# EAGLE design powermeter (EAGLE 5.11)
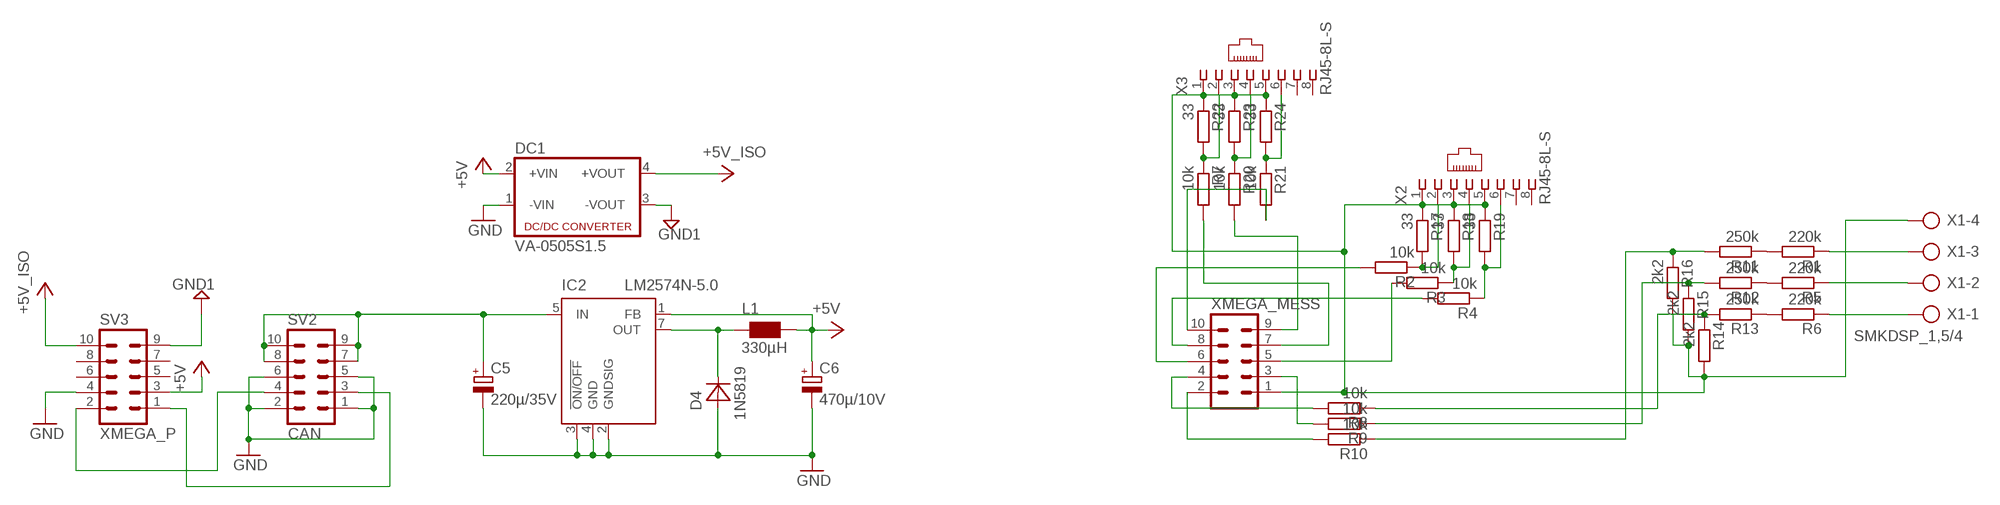
[diagram p0: schematic, sheet 1]

## Parts
C5  220µ/35V  CPOL-EUE3.5-8  [E3,5-8]
C6  470µ/10V  CPOL-EUE3.5-8  [E3,5-8]
D4  1N5819  DIODE  [DO41-7]
DC1  VA-0505S1.5  [4SIL]
IC2  LM2574N-5.0  LM2574N-3.3  [DIL08]
L1  330µH  L  [FASTRON-09P]
R1  220k  R-EU_0207/10  [0207/10]
R2  10k  R-EU_M0805  [M0805]
R3  10k  R-EU_M0805  [M0805]
R4  10k  R-EU_M0805  [M0805]
R5  220k  R-EU_0207/10  [0207/10]
R6  220k  R-EU_0207/10  [0207/10]
R7  10k  R-EU_M0805  [M0805]
R8  10k  R-EU_M0805  [M0805]
R9  10k  R-EU_M0805  [M0805]
R10  10k  R-EU_M0805  [M0805]
R11  250k  R-EU_0207/10  [0207/10]
R12  250k  R-EU_0207/10  [0207/10]
R13  250k  R-EU_0207/10  [0207/10]
R14  2k2  R-EU_0207/10  [0207/10]
R15  2k2  R-EU_0207/10  [0207/10]
R16  2k2  R-EU_0207/10  [0207/10]
R17  33  R-EU_M0805  [M0805]
R18  33  R-EU_M0805  [M0805]
R19  33  R-EU_M0805  [M0805]
R20  10k  R-EU_M0805  [M0805]
R21  10k  R-EU_M0805  [M0805]
R22  33  R-EU_M0805  [M0805]
R23  33  R-EU_M0805  [M0805]
R24  33  R-EU_M0805  [M0805]
SV2  CAN  ML10L  [ML10L]
SV3  XMEGA_P  ML10  [ML10]
X1  SMKDSP_1,5/4  [SMKDSP_1,5/4]
X2  RJ45-8L-S  [RJ45-NO-SHIELD]
X3  RJ45-8L-S  [RJ45-NO-SHIELD]
XMEGA_MESS  ML10  [ML10]

## Nets
+5V: C6.+ IC2.1(FB) L1.2 SV3.3
+5V_ISO: DC1.4(+VOUT) SV3.10
+5VISO: DC1.2(+VIN) ; supply symbol labelled +5V
+V: C5.+ IC2.5(IN) SV2.7 SV2.8 SV2.9 SV2.10
GND: C5.- C6.- D4.A DC1.1(-VIN) IC2.2(GNDSIG) IC2.3(!ON/OFF) IC2.4(GND) SV2.1 SV2.2 SV2.5 SV2.6 SV3.4
GND1: DC1.3(-VOUT) SV3.9
N$1: R10.2 XMEGA_MESS.2
N$2: R1.2 R11.1
N$3: R5.2 R12.1
N$4: R6.2 R13.1
N$5: R6.1 X1.1
N$6: R5.1 X1.2
N$7: R1.1 X1.3
N$8: R9.2 XMEGA_MESS.3
N$9: R8.2 XMEGA_MESS.4
N$10: R7.1 R22.2 X3.2
N$11: R3.2 XMEGA_MESS.5
N$12: R8.1 R13.2 R14.1
N$13: R9.1 R12.2 R15.1
N$14: R10.1 R11.2 R16.1
N$15: D4.C IC2.7(OUT) L1.1
N$16: R4.2 XMEGA_MESS.8
N$17: SV2.4 SV3.2
N$18: SV2.3 SV3.1
N$19: R20.1 R23.2 X3.4
N$20: R2.2 XMEGA_MESS.6
N$21: R21.1 R24.2 X3.6
N$22: R7.2 XMEGA_MESS.7
N$23: R20.2 XMEGA_MESS.9
N$24: R21.2 XMEGA_MESS.10
N$28: R2.1 R17.2 X2.2
N$29: R3.1 R18.2 X2.4
N$30: R4.1 R19.2 X2.6
VGND: R14.2 R15.2 R16.2 R17.1 R18.1 R19.1 R22.1 R23.1 R24.1 X1.4 X2.1 X2.3 X2.5 X3.1 X3.3 X3.5 XMEGA_MESS.1
Unconnected: SV3.5 SV3.6 SV3.7 SV3.8 X2.7 X2.8 X3.7 X3.8

## Library data of the parts
C5 C6 = rcl:CPOL-EU: POLARIZED CAPACITOR, European symbol
D4 = lab_node:DIODE
DC1 = dc-dc-converter:VA-*?: DC DC Converter Single Output, 1 Watt Motien Technology Co.,Ltd. Source: va-serie.pdf
IC2 = linear:LM2574?-*: SIMPLE SWITCHER 0.5A Step-Down Voltage Regulator Source: http://cache.national.com/ds/LM/LM2574.pdf
L1 = lab_node:L
R1-R24 = rcl:R-EU_: RESISTOR, European symbol
SV2 = con-ml:ML10L: HARTING
SV3 XMEGA_MESS = con-ml:ML10: HARTING
X1 = con-phoenix-smkdsp:SMKDSP_1,5/4: Printklemme, Nennstrom: 17,5 A, Bemessungsspannung: 250 V, Raster: 5,0 mm Source: http://eshop.phoenixcontact.de .. 1733415.pdf
X2 X3 = con-tycoelectronics:RJ45: CORCOM Modular RJ Jacks No Shield Source: www.tycoelectronics.com .. ENG_DS_1654001_1099_RJ_L_0507.pdf

## Board
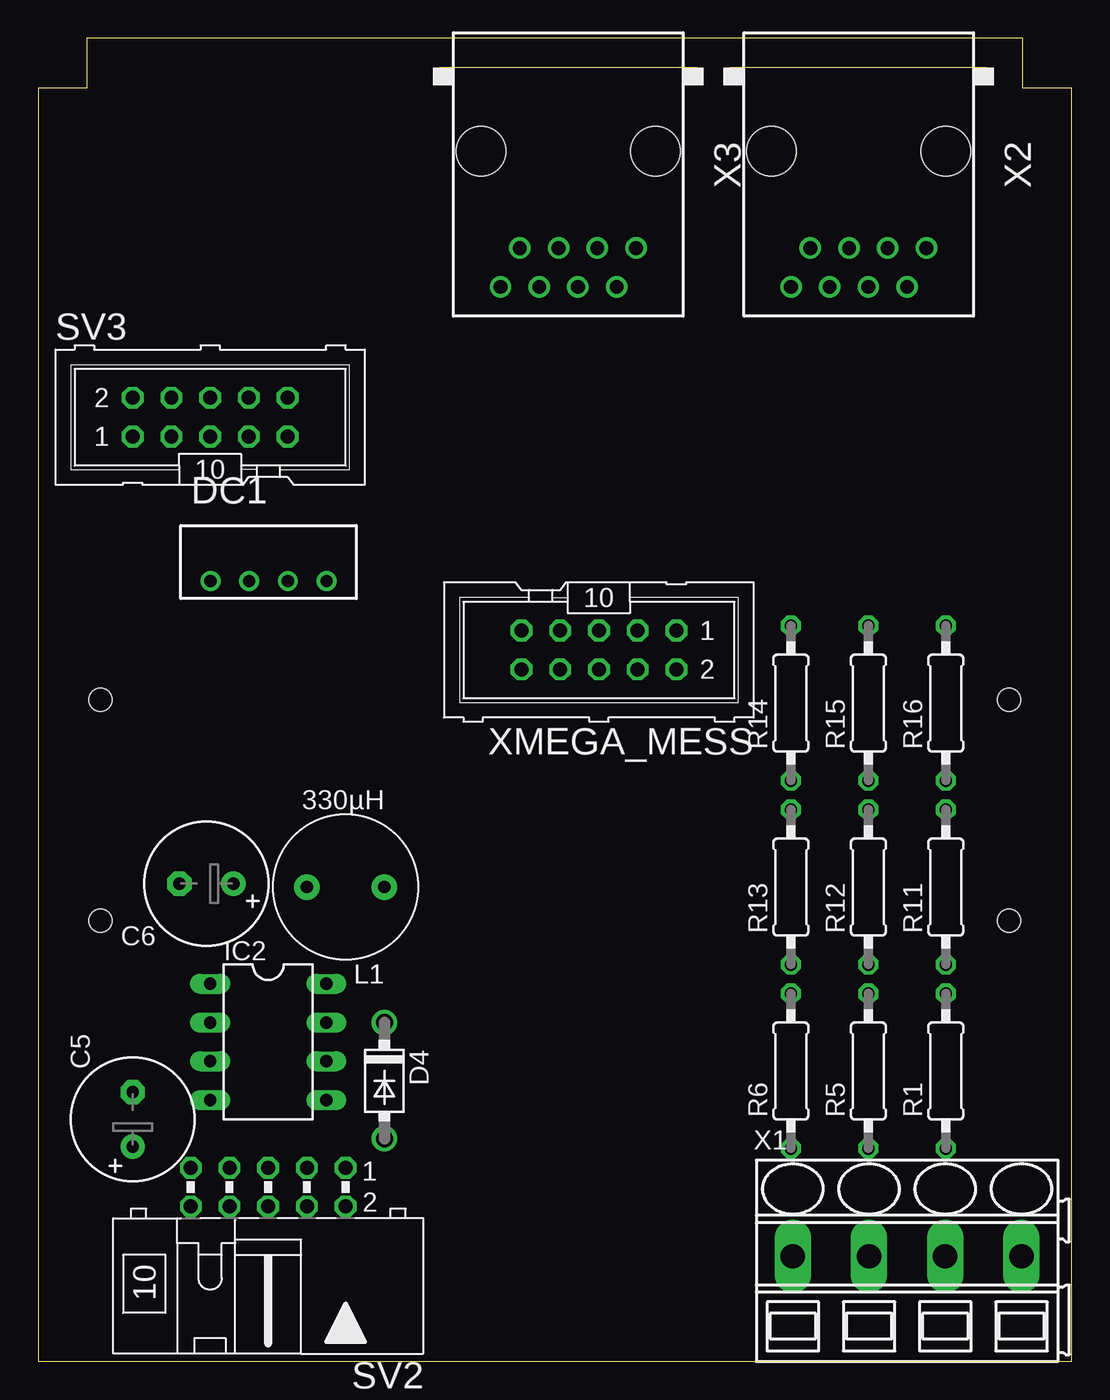
[diagram p1: board, top side]
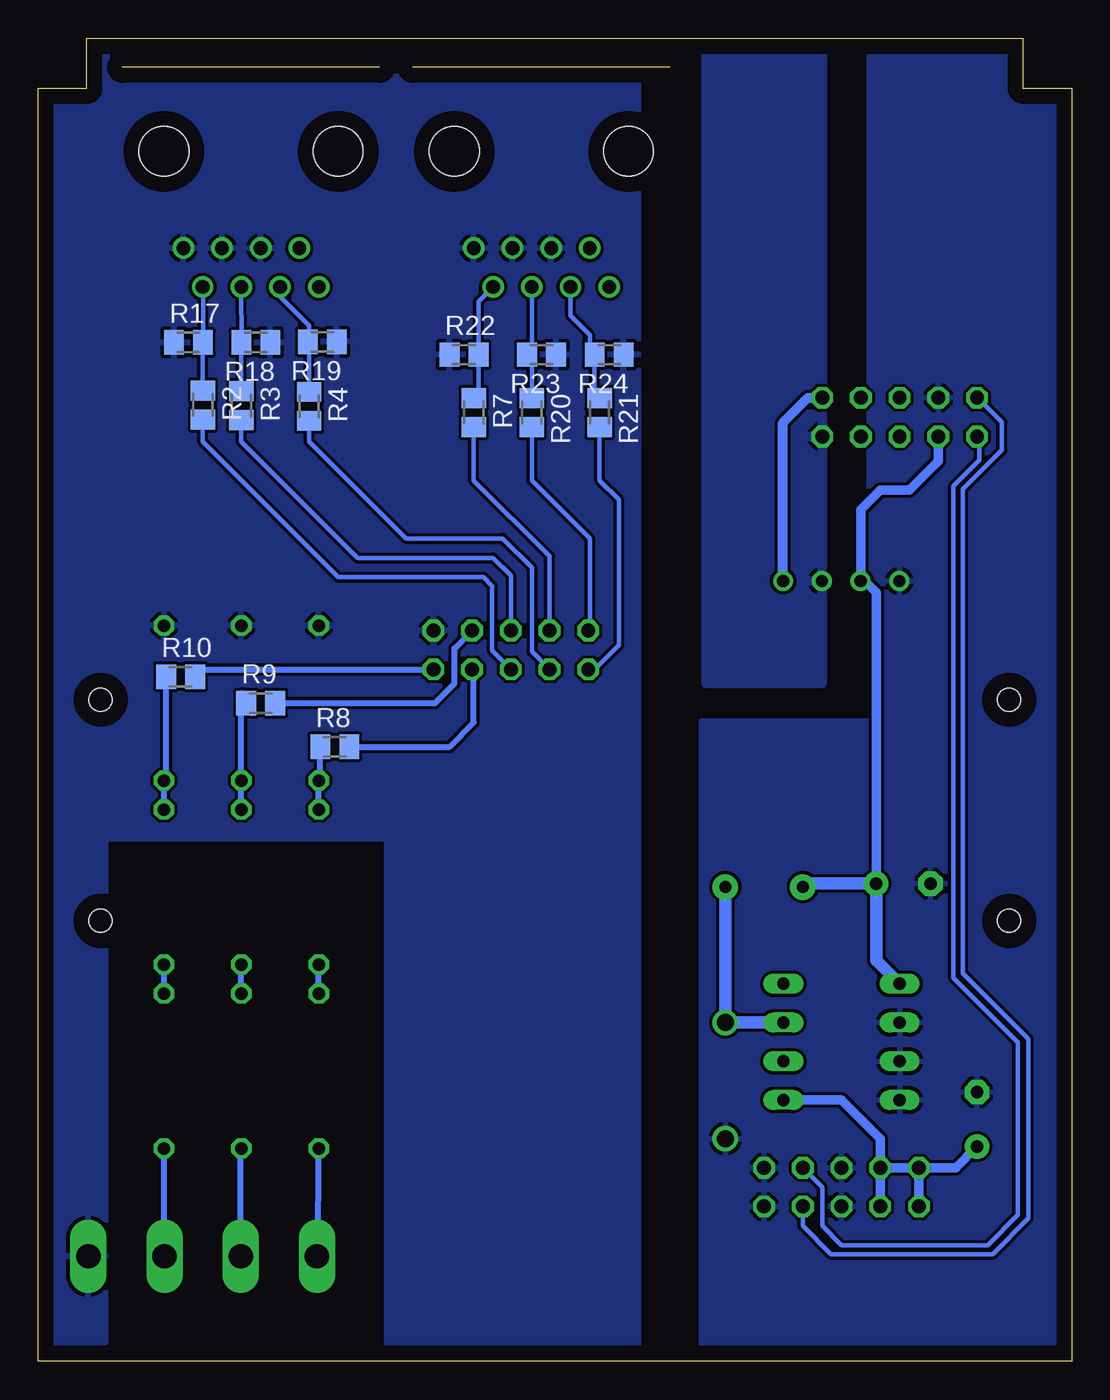
[diagram p2: board, bottom side, seen from below]

Size 67.8 x 86.8 mm. Coordinates in mm from the lower left corner, seen from the top.
Outline: 67.8,0 67.8,83.5 64.6,83.5 64.6,86.8 3.2,86.8 3.2,83.5 0,83.5 0,0 67.8,0
Copper layers (1*16): Top 0.035mm / dielectric 1.5mm / Bottom 0.035mm
Design rules: minimum track width 10mil, minimum drill 24mil, track to track 8mil, track to pad 8mil, pad to pad 8mil, via to via 8mil, smd to smd 8mil, copper to edge 40mil, drill to drill 8mil, minimum pad ring 10mil, minimum via ring 8mil, stop-mask expansion 4mil, vias tented up to drill 0mil, thermal gap 10mil
Holes 1.5 mm at 4.1,43.4 4.1,28.9 63.7,43.4 63.7,28.9

### Footprints (pad centres in the part's own frame; a part is rotated, then mirrored left to right if it is on the bottom)
E3,5-8 = drill 0.813 pad 1.6: + -1.778,0 | drill 0.813 pad 1.6 octagon: - 1.778,0
DO41-7 = drill 1.118: A 3.81,0; C -3.81,0
4SIL = drill 0.8: 1 -3.81,0; 2 -1.27,0; 3 1.27,0; 4 3.81,0
DIL08 = drill 0.813 long: 1 -3.81,-3.81; 2 -1.27,-3.81; 3 1.27,-3.81; 4 3.81,-3.81; 5 3.81,3.81; 6 1.27,3.81; 7 -1.27,3.81; 8 -3.81,3.81
FASTRON-09P = drill 0.8 pad 1.676: 1 -2.54,0; 2 2.54,0
0207/10 = drill 0.813 octagon: 1 -5.08,0; 2 5.08,0
M0805 = smd 1.3 x 1.6: 1 -0.95,0; 2 0.95,0
ML10L = drill 0.914 octagon: 1 -5.08,-1.27; 2 -5.08,1.27; 3 -2.54,-1.27; 4 -2.54,1.27; 5 0,-1.27; 6 0,1.27; 7 2.54,-1.27; 8 2.54,1.27; 9 5.08,-1.27; 10 5.08,1.27
ML10 = drill 0.914 octagon: 1 -5.08,-1.27; 2 -5.08,1.27; 3 -2.54,-1.27; 4 -2.54,1.27; 5 0,-1.27; 6 0,1.27; 7 2.54,-1.27; 8 2.54,1.27; 9 5.08,-1.27; 10 5.08,1.27
SMKDSP_1,5/4 = drill 1.6 pad 1.8 long: 1 -2.5,0; 2 2.5,0; 3 7.5,0; 4 12.5,0
RJ45-NO-SHIELD = drill 0.9 pad 1.4: 1 -4.445,6.35; 2 -3.175,8.89; 3 -1.905,6.35; 4 -0.635,8.89; 5 0.635,6.35; 6 1.905,8.89; 7 3.175,6.35; 8 4.445,8.89 | hole 3.251: -5.715,0; 5.715,0

### Placement (x,y rotation side)
C5  6.21,15.88 90 top
C6  11.04,31.34 180 top
D4  22.71,18.41 270 top
DC1  15.12,51.19 0 top
IC2  15.1,20.95 270 top
L1  20.18,31.11 180 top
R1  59.54,19.05 90 top
R2  56.99,62.73 270 bottom
R3  54.47,62.7 270 bottom
R4  50.02,62.65 270 bottom
R5  54.46,19.05 90 top
R6  49.38,19.05 90 top
R7  39.22,62.23 270 bottom
R8  48.33,40.31 0 bottom
R9  53.2,43.18 0 bottom
R10  58.45,44.91 0 bottom
R11  59.54,31.11 90 top
R12  54.46,31.11 90 top
R13  49.38,31.11 90 top
R14  49.38,43.18 90 top
R15  54.46,43.18 90 top
R16  59.54,43.18 90 top
R17  57.93,66.83 0 bottom
R18  53.51,66.84 180 bottom
R19  49.15,66.88 180 bottom
R20  35.41,62.23 270 bottom
R21  30.97,62.23 270 bottom
R22  39.86,66.04 0 bottom
R23  34.78,66.04 180 bottom
R24  30.34,66.04 180 bottom
SV2  15.1,11.43 180 top
SV3  11.29,61.94 0 top
X1  52.01,6.89 0 top
X2  53.83,79.38 180 top
X3  34.78,79.38 180 top
XMEGA_MESS  36.79,46.66 180 top

### Tracks (layer width: path | path; a pad name or v marks a point on that pad's centre or on a via)
+5V
  Bottom 0.61: SV3.3 8.75,59.05 10.65,57.15 12.55,57.15 13.83,55.88 13.83,51.44 12.82,50.43 C6.+
  Bottom 0.813: IC2.1 12.82,26.3 C6.+ 17.41,31.34 L1.2
+5V_ISO
  Bottom 0.65: DC1.4 18.93,61.58 17.3,63.2 SV3.10
+V
  Bottom 0.61: SV2.9 SV2.10 | SV2.8 SV2.7 | SV2.7 SV2.9 | IC2.5 15.1,17.14 12.55,14.61 SV2.7 | SV2.9 7.6,12.7 C5.+
GND
  pour Bottom: -0.7,-1 -0.7,86.67 13.3,86.67 13.3,42 24.3,42 24.3,-1
GND1
  pour Bottom: 16.37,44.45 16.37,87.63 23.98,87.63 23.98,44.45
N$1
  Bottom 0.406: XMEGA_MESS.2 57.02,45.4 R10.2
N$2
  Bottom 0.406: R1.2 R11.1
N$3
  Bottom 0.406: R5.2 R12.1
N$4
  Bottom 0.406: R6.2 R13.1
N$5
  Bottom 0.406: X1.1 49.42,6.99 R6.1
N$6
  Bottom 0.406: R5.1 54.51,13.93 X1.2
N$7
  Bottom 0.406: X1.3 59.54,6.93 R1.1
N$8
  Bottom 0.406: R9.2 41.76,43.18 40.49,44.45 40.49,46.77 XMEGA_MESS.3
N$9
  Bottom 0.406: R8.2 40.82,40.31 39.22,41.91 39.22,45.29 XMEGA_MESS.4
N$10
  Bottom 0.305: X3.2 38.91,69.53 R22.2 38.91,63.49 R7.1
N$11
  Bottom 0.305: 36.77,47.95 XMEGA_MESS.5 36.79,51.54 37.95,52.7 46.84,52.7 54.46,60.33 R3.2
N$12
  Bottom 0.406: R13.2 R14.1 49.28,38.2 R8.1
N$13
  Bottom 0.406: R12.2 R15.1 54.46,43.81 arc90 54.14,43.49 R9.1
N$14
  Bottom 0.406: R11.2 R16.1 arc-90 59.4,38.24 R10.1
N$15
  Bottom 0.813: IC2.7 D4.C L1.1
N$16
  Bottom 0.305: R4.2 50.02,60.33 43.67,53.98 37.32,53.98 35.41,52.07 35.41,46.56 XMEGA_MESS.8
N$17
  Bottom 0.305: SV2.4 17.64,8.89 15.79,7.04 5.18,7.04 2.85,9.37 2.85,21.17 7.13,25.45 7.13,57.21 4.57,59.77 4.57,61.6 6.18,63.2 SV3.2
N$18
  Bottom 0.305: SV2.3 16.37,11.43 16.37,8.89 15.1,7.62 5.5,7.62 3.52,9.6 3.52,20.93 7.76,25.17 7.76,57.41 6.04,59.13 6.04,60.5 SV3.1
N$19
  Bottom 0.305: R20.1 35.41,65.72 R23.2 35.41,66.36 X3.4
N$20
  Bottom 0.305: XMEGA_MESS.6 38.02,46.62 38.02,50.87 38.59,51.44 48.11,51.44 57,60.33 57,61.77 R2.2
N$21
  Bottom 0.305: X3.6 32.88,68.58 31.61,67.31 31.61,66.36 R24.2 31.29,63.49 R21.1
N$22
  Bottom 0.305: XMEGA_MESS.7 34.25,52.81 39.22,57.78 R7.2
N$23
  Bottom 0.305: XMEGA_MESS.9 31.61,48.04 31.61,53.98 35.41,57.78 R20.2
N$24
  Bottom 0.305: XMEGA_MESS.10 31.3,45.4 29.7,46.99 29.7,56.52 30.97,57.78 R21.2
N$28
  Bottom 0.305: R2.1 R17.2 56.98,70.16 X2.2
N$29
  Bottom 0.305: X2.4 R18.2 R3.1
N$30
  Bottom 0.305: X2.6 51.92,69.85 50.02,67.94 50.02,66.97 R19.2 50.02,66.8 R4.1
VGND
  pour Bottom: 28.43,0.64 28.43,87 67.78,87 67.78,1.27 63.35,1.27 63.35,34.29 44.94,34.29 44.94,0.64